# EAGLE design Programmer (EAGLE 6.3)
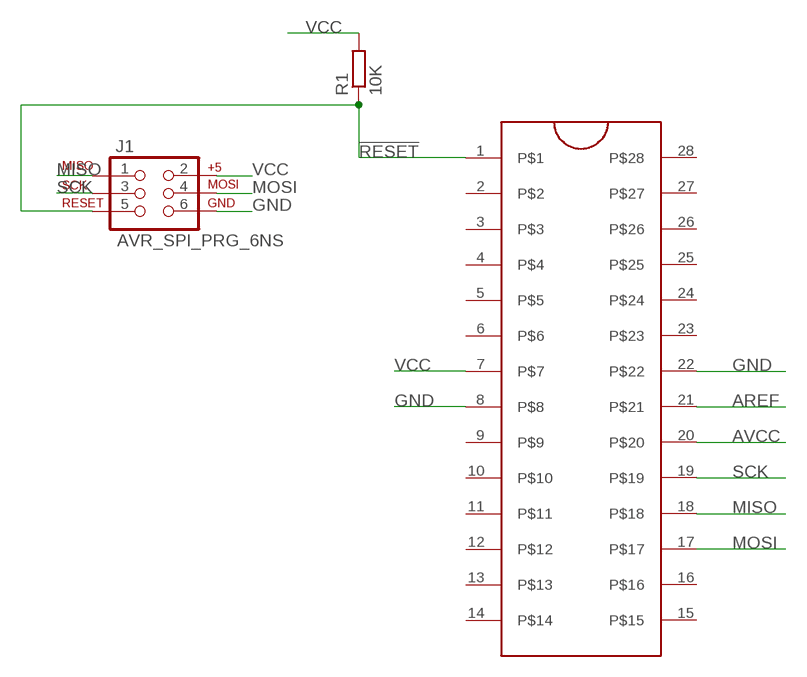
[diagram p0: schematic, sheet 1]

## Parts
J1  AVR_SPI_PRG_6NS  [2X3-NS]
R1  10K  R-EU_0207/10  [0207/10]
U$1  ZIFSOCKET-28-3ZIFFSOCKET-28-3  [DIL28-3-ZIF_SOCKET]

## Nets
!RESET!: J1.5 R1.1 U$1.1
AREF: U$1.21
AVCC: U$1.20
GND: J1.6 U$1.8 U$1.22
MISO: J1.1 U$1.18
MOSI: J1.4 U$1.17
SCK: J1.3 U$1.19
VCC: J1.2 R1.2 U$1.7
Unconnected: U$1.2 U$1.3 U$1.4 U$1.5 U$1.6 U$1.9 U$1.10 U$1.11 U$1.12 U$1.13 U$1.14 U$1.15 U$1.16 U$1.23 U$1.24 U$1.25 U$1.26 U$1.27 U$1.28

## Library data of the parts
J1 = SparkFun-Connectors:AVR_SPI_PRG_6: AVR ISP 6 Pin This is the reduced ISP connector for AVR programming. Common on Arduino. This footprint will take up less PCB space and can be used with a 10-pin to 6-pin adapter such as SKU: BOB-08508
R1 = rcl:R-EU_: RESISTOR, European symbol
U$1 = SparkFun-Connectors:ZIFSOCKET-28-3: Lever-action ZIF socket for 28-pin ICs

## Board
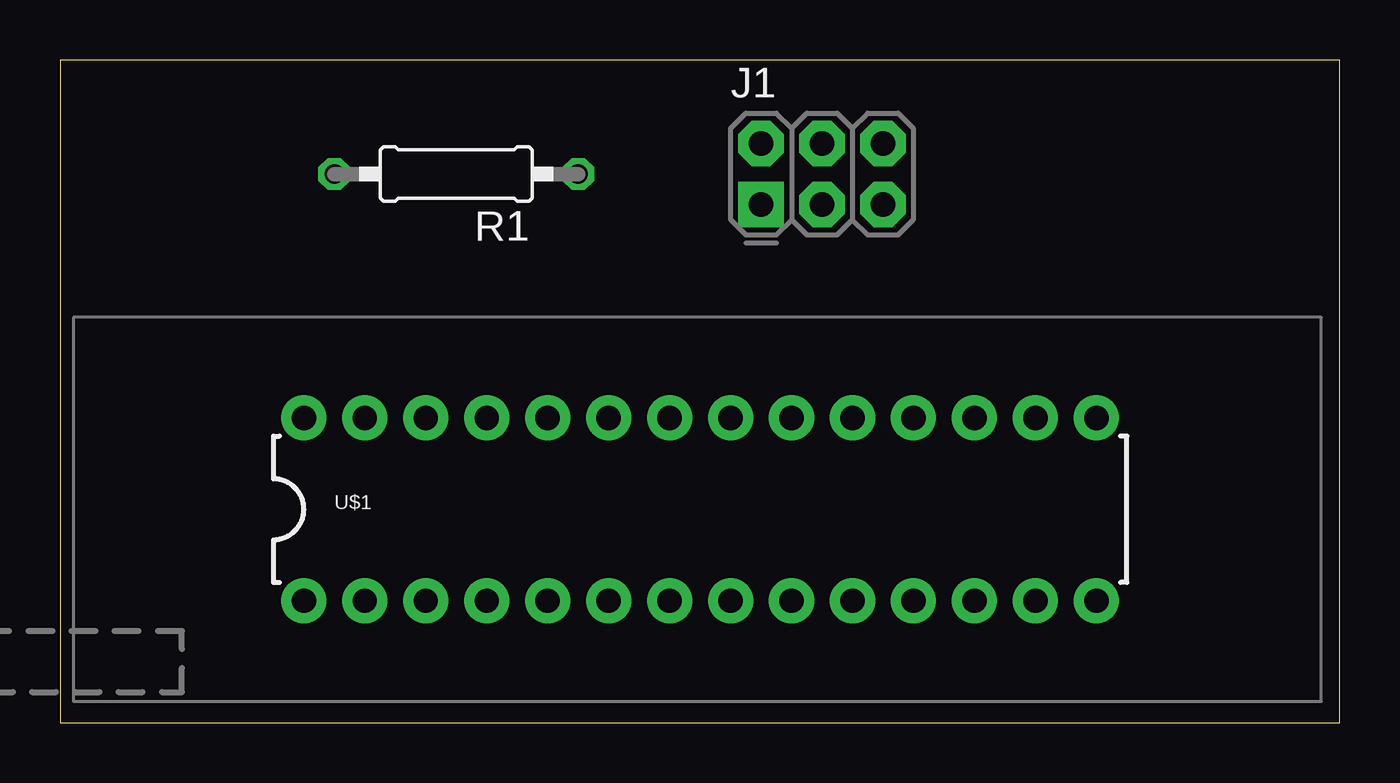
[diagram p1: board, top side]
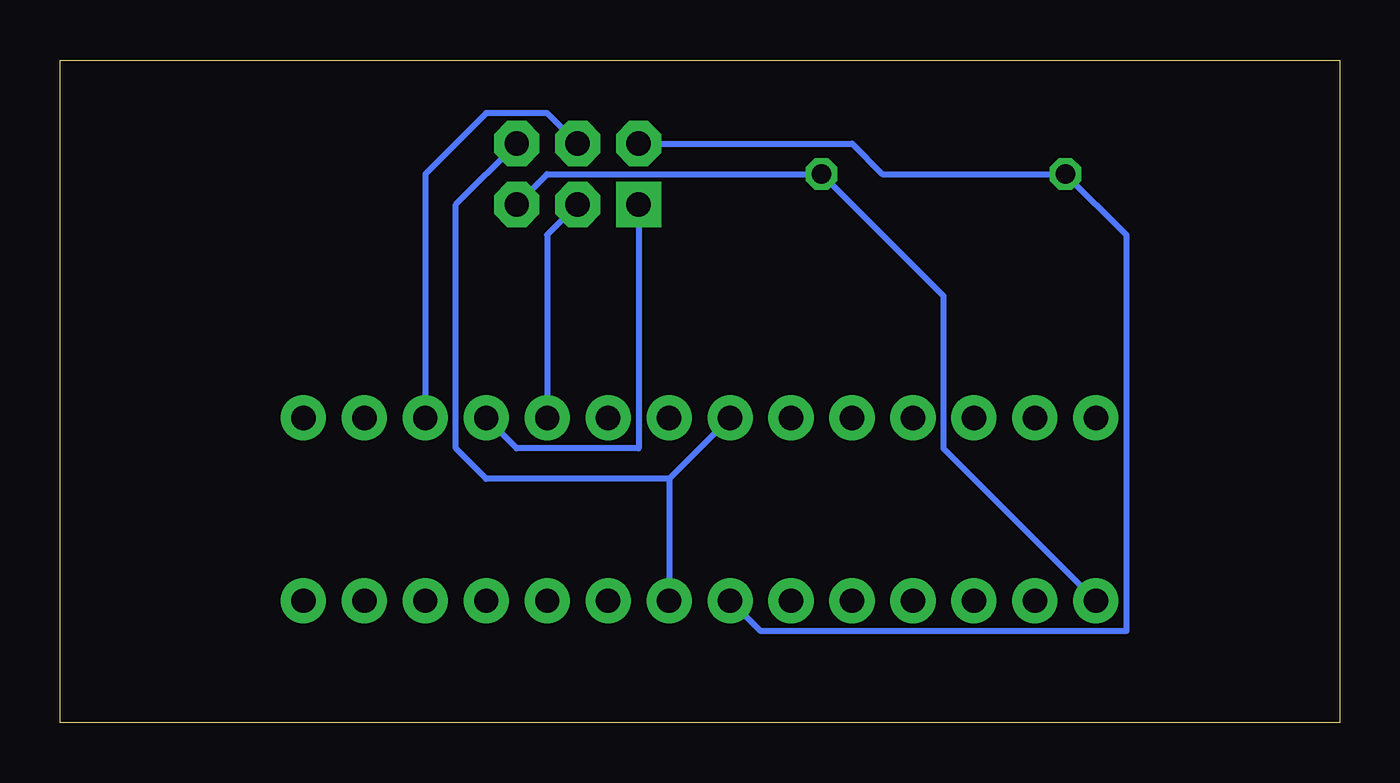
[diagram p2: board, bottom side, seen from below]

Size 53.32 x 27.61 mm. Coordinates in mm from the lower left corner, seen from the top.
Outline: 0,0 53.32,0 53.32,27.61 0,27.61 0,0
Copper layers (1*16): Top 0.035mm / dielectric 1.5mm / Bottom 0.035mm
Design rules "default": minimum track width 10mil, minimum drill 24mil, track to track 8mil, track to pad 8mil, pad to pad 8mil, via to via 8mil, smd to smd 8mil, copper to edge 40mil, drill to drill 8mil, minimum pad ring 10mil, minimum via ring 8mil, stop-mask expansion 4mil, vias tented up to drill 0mil, thermal gap 10mil

### Footprints (pad centres in the part's own frame; a part is rotated, then mirrored left to right if it is on the bottom)
2X3-NS = drill 1.016 pad 1.88 square: 1 -2.54,-1.27 | drill 1.016 pad 1.88 octagon: 2 -2.54,1.27; 3 0,-1.27; 4 0,1.27; 5 2.54,-1.27; 6 2.54,1.27
0207/10 = drill 0.813 octagon: 1 -5.08,0; 2 5.08,0
DIL28-3-ZIF_SOCKET = drill 1.016 pad 1.88: 1 -16.51,-3.81; 2 -13.97,-3.81; 3 -11.43,-3.81; 4 -8.89,-3.81; 5 -6.35,-3.81; 6 -3.81,-3.81; 7 -1.27,-3.81; 8 1.27,-3.81; 9 3.81,-3.81; 10 6.35,-3.81; 11 8.89,-3.81; 12 11.43,-3.81; 13 13.97,-3.81; 14 16.51,-3.81; 15 16.51,3.81; 16 13.97,3.81; 17 11.43,3.81; 18 8.89,3.81; 19 6.35,3.81; 20 3.81,3.81; 21 1.27,3.81; 22 -1.27,3.81; 23 -3.81,3.81; 24 -6.35,3.81; 25 -8.89,3.81; 26 -11.43,3.81; 27 -13.97,3.81; 28 -16.51,3.81

### Placement (x,y rotation side)
J1  31.75,22.86 0 top
R1  16.51,22.86 180 top
U$1  26.67,8.89 0 top

### Tracks (layer width: path | path; a pad name or v marks a point on that pad's centre or on a via)
!RESET!
  Bottom 0.254: J1.5 33.02,22.86 R1.1 16.51,17.78 16.51,11.43 U$1.1
GND
  Bottom 0.254: 27.94,10.16 U$1.8 | U$1.22 27.94,10.16 | J1.6 36.83,21.59 36.83,11.43 35.56,10.16 27.94,10.16
MISO
  Bottom 0.254: U$1.18 34.29,11.43 29.21,11.43 J1.1
MOSI
  Bottom 0.254: U$1.17 38.1,22.86 35.56,25.4 33.02,25.4 J1.4
SCK
  Bottom 0.254: U$1.19 33.02,20.32 J1.3
VCC
  Bottom 0.254: J1.2 20.32,24.13 19.05,22.86 R1.2 8.89,20.32 8.89,3.81 24.13,3.81 U$1.7

### Text on the board
bPlace: TODO bigger pads from SimpleEagleLibrary